# Altium schematic sheet Line 12V.SchDoc
size A4; SheetNumber: 12; SheetTotal: 13
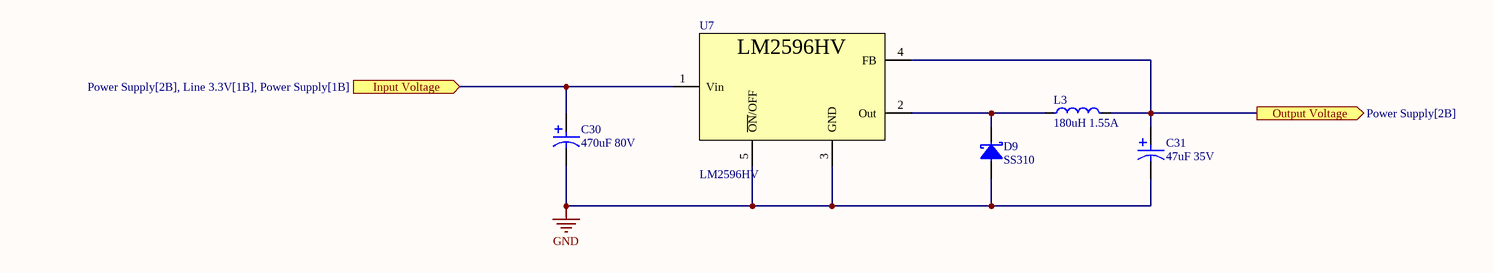
[diagram p0: Line 12V.SchDoc]

## Parts
C30  470uF 80V  [BAR CAP 18x16.5]
C31  47uF 35V  [BAR CAP 6.3x5.4]
D9  SS310  [DIODE: SMB]
L3  180uH 1.55A  [Inductor 12x12x8]
U7  LM2596HV  [TO-263-5L]

## Ports
Input Voltage (in, see Power Supply[2B], Line 3.3V[1B], Power Supply[1B]), Output Voltage (out, see Power Supply[2B])

## Nets
GND: C30.1 C31.1 D9.1 U7.3(GND) U7.5(~{ON}/OFF)
Input Voltage: C30.2 U7.1(Vin) ; port Input Voltage
Output Voltage: C31.2 L3.2 U7.4(FB) ; port Output Voltage
NetD9_2: D9.2 L3.1 U7.2(Out)

## Library data of the parts
C30 = Capacitor 470uF 80V (18x16.5mm): EEVFK1K471M 470uF 80V ±20% (18 X 16.5mm); ComponentLink1Description: Buy; ComponentLink1URL: https://www.promelec.ru/product/379561/; Type: Capacitor; ComponentLink2Description: Datasheet; ComponentLink2URL: https://www.promelec.ru/fs/sources/5c/ca/9a/77/f078999f3a45613147463444.pdf
C31 = Capacitor 47uF 35V (6.3x5.4mm): 47uF 35V 6.3Х5.4mm; Type: Capacitor; ComponentLink1Description: Buy; ComponentLink1URL: https://radioremont.com/product/kondensator-47mkf-35v-6-3kh5-4mm-e5-10/
D9 = Schottky diode SS310: 100B 3.0A Schottky diode; ComponentLink1Description: Buy; ComponentLink1URL: https://radioremont.com/product/diod-ss310-k181-17/#/overview/; Type: Diode; ComponentLink2Description: Datasheet; ComponentLink2URL: https://radioremont.com/wa-data/public/shop/products/99/92/9299/attachments/SS32%20–%20SS310.pdf
L3 = Inductor 180uH 1.55A: CDRH127/LDNP-181MC 180uH ±20% 1.55A 0.23Ohm; Type: Inductor; ComponentLink1Description: Buy; ComponentLink1URL: https://www.promelec.ru/product/341912/; ComponentLink2Description: Datasheet; ComponentLink2URL: https://www.promelec.ru/fs/sources/fa/ff/e0/e8/56649ef2044eaab80fc28690.pdf
U7 = DC/DC Buck LM2596HV: 3A Step-Down Voltage Regulator; Type: DC/DC; ComponentLink1Description: Buy; ComponentLink1URL: https://www.promelec.ru/product/524519/; ComponentLink2Description: Datasheet; ComponentLink2URL: https://www.promelec.ru/fs/sources/a0/fc/d0/b9/f7d293b95336dd7dbb3040f8.pdf